# EAGLE schematic Team_SAFE_AlertingCircuit final_Schematic (EAGLE 9.7.0)
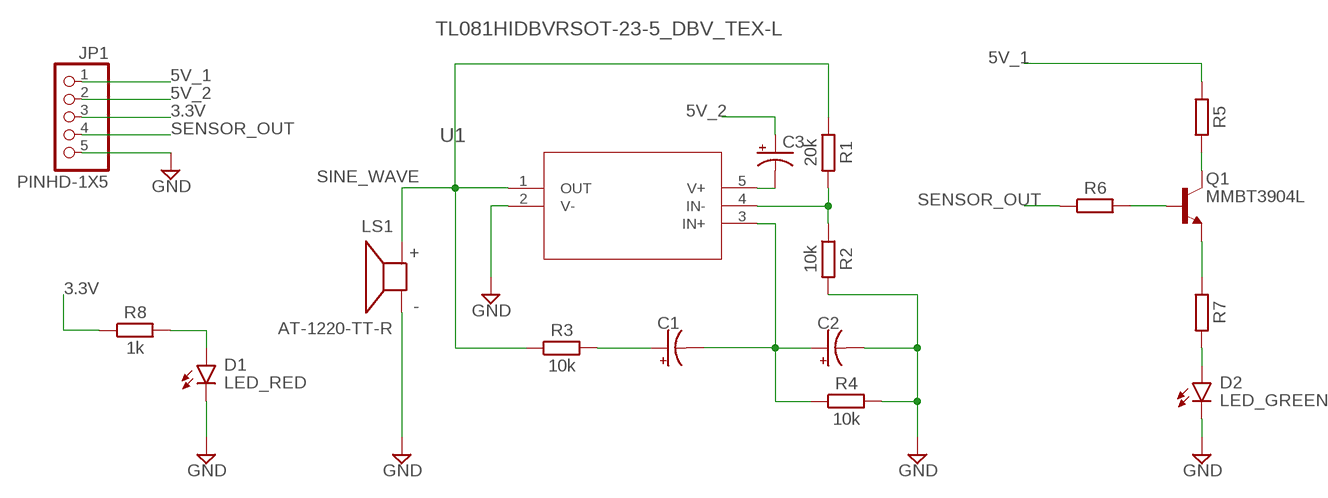
[diagram p0: schematic, sheet 1]

## Parts
C1  C-POL-US_TANTALUM-1206(3216-METRIC)  [CAPMP3216X180N]
C2  C-POL-US_TANTALUM-1206(3216-METRIC)  [CAPMP3216X180N]
C3  C-POL-US_TANTALUM-1206(3216-METRIC)  [CAPMP3216X180N]
D1  LED_RED  CHIP-ROUND-R_1206  [LEDC3216X180N_RND-R]
D2  LED_GREEN  CHIP-ROUND-G_1206  [LEDC3216X180N_RND-G]
JP1  PINHD-1X5  [1X05]
LS1  AT-1220-TT-R  [XDCR_AT-1220-TT-R]
Q1  MMBT3904L  NPN_MMBT3904LT1G_SOT23-BEC  [SOT95P237X112-3N]
R1  20k  RESISTOR__CHIP-0805(2012-METRIC)  [RESC2012X65]
R2  10k  RESISTOR__CHIP-0805(2012-METRIC)  [RESC2012X65]
R3  10k  RESISTOR__CHIP-0805(2012-METRIC)  [RESC2012X65]
R4  10k  RESISTOR__CHIP-0805(2012-METRIC)  [RESC2012X65]
R5  RESISTOR__CHIP-0805(2012-METRIC)  [RESC2012X65]
R6  RESISTOR__CHIP-0805(2012-METRIC)  [RESC2012X65]
R7  RESISTOR__CHIP-0805(2012-METRIC)  [RESC2012X65]
R8  1k  RESISTOR__CHIP-0805(2012-METRIC)  [RESC2012X65]
U1  TL081HIDBVRSOT-23-5_DBV_TEX-L  [SOT-23-5_DBV_TEX-L]

## Nets
3.3V: JP1.3 R8.1
5V_1: JP1.1 R5.1
5V_2: C3.1(+) JP1.2
GND: C2.2(-) D1.C D2.C JP1.5 LS1.N R2.2 R4.2 U1.2(V-)
N$1: R1.2 R2.1 U1.4(IN-)
N$4: C1.1(+) R3.2
N$5: C1.2(-) C2.1(+) R4.1 U1.3(IN+)
N$6: C3.2(-) U1.5(V+)
N$7: Q1.3(C) R5.2
N$8: Q1.1(B) R6.2
N$9: Q1.2(E) R7.1
N$10: D2.A R7.2
N$13: D1.A R8.2
SENSOR_OUT: JP1.4 R6.1
SINE_WAVE: LS1.P R1.1 R3.1 U1.1(OUT)

## Library data of the parts
C1-C3 = Capacitor:C-POL-US: Capacitor Polarised - ANSI; CATEGORY: Capacitor
D1 = LED:CHIP-ROUND-R: LED - Generic; CATEGORY: LED; COLOR: RED; DESCRIPTION: CHIP LED ROUND; SUB-CATEGORY: CHIP; TYPE: ROUND_TOP
D2 = LED:CHIP-ROUND-G; CATEGORY: LED; COLOR: GREEN; DESCRIPTION: CHIP LED ROUND; SUB-CATEGORY: CHIP; TYPE: ROUND_TOP
JP1 = Connector:PINHD-1X5: PIN HEADER; CATEGORY: Headers; DESCRIPTION: Header, Straight, 5 Position; MANUFACTURER: Generic; MPN: Generic; OPERATING_TEMPERATURE: Generic; PART_STATUS: Active; PITCH: 0.100" (2.54mm); ROHS_COMPLIANCE: Generic; SERIES: Generic; SUB-CATEGORY: Headers, Male Pins; TYPE: Board to Board or Cable, Unshrouded, Through Hole, Straight
LS1 = AT-1220-TT-R:AT-1220-TT-R: AUDIO TRANSDUCER 12 VP-P 85 DB 2400 HZ; MANUFACTURER: PUI Audio; MAXIMUM_PACKAGE_HEIGHT: 9.8 mm; PARTREV: 2014/07/25; STANDARD: Manufacturer Recommendations
Q1 = Transistor:NPN_: NPN - Popular parts; CATEGORY: Transistor; DESCRIPTION: TRANS NPN 40V 0.2A SOT23; MANUFACTURER: ON Semiconductor; SUB-CATEGORY: BJT; TYPE: NPN
R1-R8 = Tinkercad:RESISTOR: Resistor Fixed - Generic; CATEGORY: Resistor; SUB-CATEGORY: Fixed
U1 = 2024-11-09_00-50-43_Library:TL081HIDBVR; COPYRIGHT: Copyright (C) 2024 Ultra Librarian. All rights reserved.; MANUFACTURER_PART_NUMBER: TL081HIDBVR; MFR_NAME: Texas Instruments